# Altium project DUTBoard.PrjPcb (part 2 of 5)

## Sheet SRAM_WRP.SchDoc
size A; DocumentNumber: 3; SheetNumber: 3; SheetTotal: 13
Used 8 times, as channels U_SRAM_BANK/U_SRAM_WRP, U_SRAM_BANK/U_SRAM_WRP, U_SRAM_BANK/U_SRAM_WRP, U_SRAM_BANK/U_SRAM_WRP, U_SRAM_BANK/U_SRAM_WRP, U_SRAM_BANK/U_SRAM_WRP, U_SRAM_BANK/U_SRAM_WRP, U_SRAM_BANK/U_SRAM_WRP. Parts and nets are listed once, with the designators drawn on the sheet.
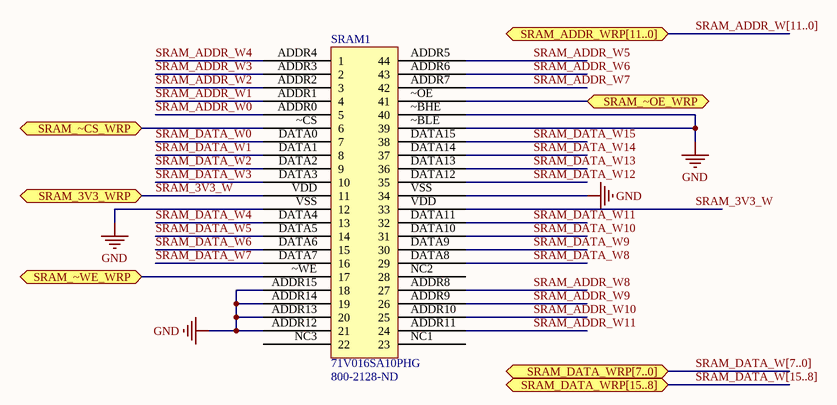
[diagram p8: SRAM_WRP.SchDoc]

### Parts
SRAM1  71V016SA10PHG  Supplier Part Number 1: 800-2128-ND  [SRAM_TSSOP44-II]

### Ports
SRAM_3V3_WRP, SRAM_ADDR_WRP[11..0], SRAM_DATA_WRP[7..0], SRAM_DATA_WRP[15..8], SRAM_~CS_WRP, SRAM_~OE_WRP, SRAM_~WE_WRP

### Nets
GND: SRAM1.ADDR12(21) SRAM1.ADDR13(20) SRAM1.ADDR14(19) SRAM1.ADDR15(18) SRAM1.VSS(12) SRAM1.~BHE(40) SRAM1.~BLE(39)
SRAM_3V3_W: SRAM1.VDD(11) ; port SRAM_3V3_WRP
SRAM_ADDR_W0: SRAM1.ADDR0(5)
SRAM_ADDR_W1: SRAM1.ADDR1(4)
SRAM_ADDR_W2: SRAM1.ADDR2(3)
SRAM_ADDR_W3: SRAM1.ADDR3(2)
SRAM_ADDR_W4: SRAM1.ADDR4(1)
SRAM_ADDR_W5: SRAM1.ADDR5(44)
SRAM_ADDR_W6: SRAM1.ADDR6(43)
SRAM_ADDR_W7: SRAM1.ADDR7(42)
SRAM_ADDR_W8: SRAM1.ADDR8(27)
SRAM_ADDR_W9: SRAM1.ADDR9(26)
SRAM_ADDR_W10: SRAM1.ADDR10(25)
SRAM_ADDR_W11: SRAM1.ADDR11(24)
SRAM_DATA_W0: SRAM1.DATA0(7)
SRAM_DATA_W1: SRAM1.DATA1(8)
SRAM_DATA_W2: SRAM1.DATA2(9)
SRAM_DATA_W3: SRAM1.DATA3(10)
SRAM_DATA_W4: SRAM1.DATA4(13)
SRAM_DATA_W5: SRAM1.DATA5(14)
SRAM_DATA_W6: SRAM1.DATA6(15)
SRAM_DATA_W7: SRAM1.DATA7(16)
SRAM_DATA_W8: SRAM1.DATA8(29)
SRAM_DATA_W9: SRAM1.DATA9(30)
SRAM_DATA_W10: SRAM1.DATA10(31)
SRAM_DATA_W11: SRAM1.DATA11(32)
SRAM_DATA_W12: SRAM1.DATA12(35)
SRAM_DATA_W13: SRAM1.DATA13(36)
SRAM_DATA_W14: SRAM1.DATA14(37)
SRAM_DATA_W15: SRAM1.DATA15(38)
SRAM_~CS_WRP: SRAM1.~CS(6) ; port SRAM_~CS_WRP
SRAM_~OE_WRP: SRAM1.~OE(41) ; port SRAM_~OE_WRP
SRAM_~WE_WRP: SRAM1.~WE(17) ; port SRAM_~WE_WRP

Not connected (* = marked no-connect by the designer): SRAM1 NC1(23) NC2(28) NC3(22)

### Channels
U_SRAM_BANK/U_SRAM_WRP: designators SRAM1=S7; ports SRAM_3V3_WRP=3V3 SRAM_~CS_WRP=FPGA_~CS1 SRAM_~OE_WRP=FPGA_~OE SRAM_~WE_WRP=FPGA_~WE1
U_SRAM_BANK/U_SRAM_WRP: designators SRAM1=S8; ports SRAM_3V3_WRP=3V3 SRAM_~CS_WRP=FPGA_~CS1 SRAM_~OE_WRP=FPGA_~OE SRAM_~WE_WRP=FPGA_~WE1
U_SRAM_BANK/U_SRAM_WRP: designators SRAM1=S6; ports SRAM_3V3_WRP=3V3 SRAM_~CS_WRP=FPGA_~CS2 SRAM_~OE_WRP=FPGA_~OE SRAM_~WE_WRP=FPGA_~WE2
U_SRAM_BANK/U_SRAM_WRP: designators SRAM1=S5; ports SRAM_3V3_WRP=3V3 SRAM_~CS_WRP=FPGA_~CS2 SRAM_~OE_WRP=FPGA_~OE SRAM_~WE_WRP=FPGA_~WE2
U_SRAM_BANK/U_SRAM_WRP: designators SRAM1=S4; ports SRAM_3V3_WRP=3V3 SRAM_~CS_WRP=FPGA_~CS3 SRAM_~OE_WRP=FPGA_~OE SRAM_~WE_WRP=FPGA_~WE3
U_SRAM_BANK/U_SRAM_WRP: designators SRAM1=S3; ports SRAM_3V3_WRP=3V3 SRAM_~CS_WRP=FPGA_~CS3 SRAM_~OE_WRP=FPGA_~OE SRAM_~WE_WRP=FPGA_~WE3
U_SRAM_BANK/U_SRAM_WRP: designators SRAM1=S2; ports SRAM_3V3_WRP=3V3 SRAM_~CS_WRP=FPGA_~CS4 SRAM_~OE_WRP=FPGA_~OE SRAM_~WE_WRP=FPGA_~WE4
U_SRAM_BANK/U_SRAM_WRP: designators SRAM1=S1; ports SRAM_3V3_WRP=3V3 SRAM_~CS_WRP=FPGA_~CS4 SRAM_~OE_WRP=FPGA_~OE SRAM_~WE_WRP=FPGA_~WE4

### Buses and harness runs
bus SRAM_ADDR_W[11..0] = port SRAM_ADDR_WRP[11..0]
bus SRAM_DATA_W[7..0] = port SRAM_DATA_WRP[7..0]
bus SRAM_DATA_W[15..8] = port SRAM_DATA_WRP[15..8]

### Library data of the parts
SRAM1 = 71V016SA10PHG: IC SRAM 1MBIT 10NS 44TSOP; Manufacturer: IDT, Integrated Device Technology Inc; Format - Memory: RAM; Memory Type: SRAM - Asynchronous; Memory Size: 1M (64K x 16); Interface: Parallel; Voltage - Supply: 3.15 V ~ 3.6 V; Supplier 1: Digi-Key; Manufacturer Part Number: 71V016SA10PHG; RoHS: RoHS Compliant; Category: Integrated Circuits (ICs); Stock 1: 114; Pricing 1: 1=2.64, 25=2.1252, 100=1.9125, 250=1.7, 500=1.4875, 1000=1.2325, 2500=1.1475, 5000=1.105, 10000=1.0625 (USD); Packaging: Tube; Speed: 10ns; Operating Temperature: 0°C ~ 70°C (TA); Package / Case: 44-TSOP (0.400", 10.16mm Width); Supplier Device Package: 44-TSOP II; ComponentLink1URL: http://www.idt.com/document/71v016sa-datasheet; ComponentLink1Description: http://www.idt.com/document/71v016sa-datasheet